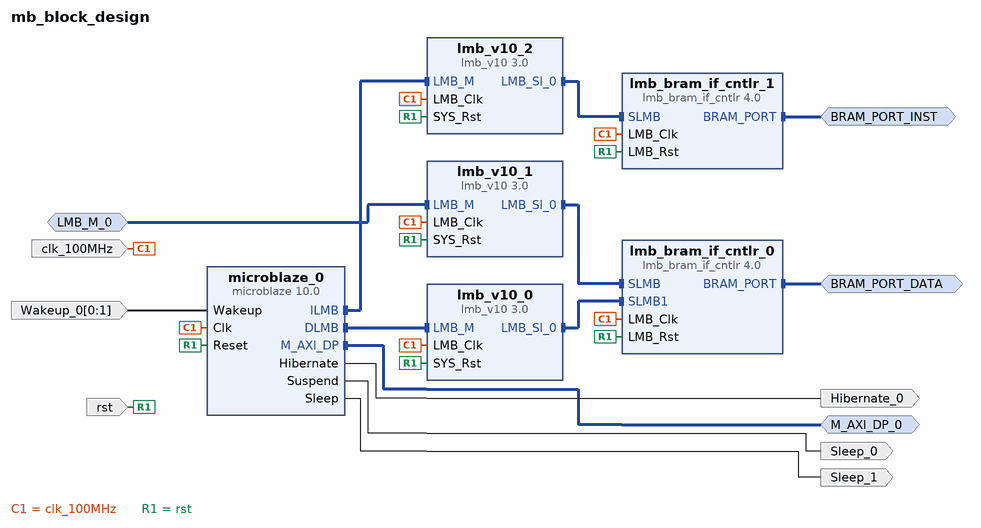
[diagram p0: block diagram of the top level]
# Vivado block design mb_block_design, xc7a200tfbg676-2, Vivado 2018.2.1
create_bd_design mb_block_design

create_bd_intf_port -mode Master -vlnv xilinx.com:interface:aximm_rtl:1.0 M_AXI_DP_0
set_property -dict [list \
  CONFIG.DATA_WIDTH 32 \
  CONFIG.PROTOCOL AXI4LITE \
  CONFIG.ADDR_WIDTH 32 \
  CONFIG.HAS_BURST 0 \
  CONFIG.HAS_LOCK 0 \
  CONFIG.HAS_CACHE 0 \
  CONFIG.HAS_QOS 0 \
  CONFIG.HAS_REGION 0 \
] [get_bd_intf_ports M_AXI_DP_0]
create_bd_intf_port -mode MirroredMaster -vlnv xilinx.com:interface:lmb_rtl:1.0 LMB_M_0
create_bd_intf_port -mode Master -vlnv xilinx.com:interface:bram_rtl:1.0 BRAM_PORT_INST
set_property -dict {CONFIG.MASTER_TYPE BRAM_CTRL} [get_bd_intf_ports BRAM_PORT_INST]
create_bd_intf_port -mode Master -vlnv xilinx.com:interface:bram_rtl:1.0 BRAM_PORT_DATA
set_property -dict {CONFIG.MASTER_TYPE BRAM_CTRL} [get_bd_intf_ports BRAM_PORT_DATA]
create_bd_port -dir I -type clk clk_100MHz
set_property -dict {CONFIG.FREQ_HZ 100000000} [get_bd_ports clk_100MHz]
create_bd_port -dir I -type rst rst
set_property -dict {CONFIG.POLARITY ACTIVE_HIGH} [get_bd_ports rst]
create_bd_port -dir I -from 0 -to 1 Wakeup_0
create_bd_port -dir O Sleep_0
create_bd_port -dir O Hibernate_0
create_bd_port -dir O Sleep_1

create_bd_cell -type ip -vlnv xilinx.com:ip:microblaze:10.0 microblaze_0
set_property -dict [list \
  CONFIG.C_INTERCONNECT 2 \
  CONFIG.C_D_AXI 1 \
  CONFIG.C_D_LMB 1 \
  CONFIG.C_I_LMB 1 \
  CONFIG.C_TRACE 0 \
  CONFIG.C_LOCKSTEP_SELECT 0 \
  CONFIG.C_ENABLE_DISCRETE_PORTS 1 \
  CONFIG.C_USE_PCMP_INSTR 1 \
  CONFIG.C_USE_BARREL 1 \
  CONFIG.C_USE_DIV 1 \
  CONFIG.C_USE_HW_MUL 1 \
  CONFIG.C_USE_FPU 1 \
  CONFIG.C_DEBUG_ENABLED 0 \
  CONFIG.C_ADDR_TAG_BITS 0 \
  CONFIG.C_DCACHE_ADDR_TAG 0 \
  CONFIG.C_USE_MMU 0 \
] [get_bd_cells microblaze_0]
create_bd_cell -type ip -vlnv xilinx.com:ip:lmb_v10:3.0 lmb_v10_0
set_property -dict {CONFIG.C_LMB_NUM_SLAVES 1} [get_bd_cells lmb_v10_0]
create_bd_cell -type ip -vlnv xilinx.com:ip:lmb_v10:3.0 lmb_v10_1
create_bd_cell -type ip -vlnv xilinx.com:ip:lmb_bram_if_cntlr:4.0 lmb_bram_if_cntlr_0
set_property -dict {CONFIG.C_NUM_LMB 2} [get_bd_cells lmb_bram_if_cntlr_0]
create_bd_cell -type ip -vlnv xilinx.com:ip:lmb_v10:3.0 lmb_v10_2
create_bd_cell -type ip -vlnv xilinx.com:ip:lmb_bram_if_cntlr:4.0 lmb_bram_if_cntlr_1

# ---- connections ----

connect_bd_intf_net [get_bd_intf_pins microblaze_0/DLMB] [get_bd_intf_pins lmb_v10_0/LMB_M]
connect_bd_intf_net [get_bd_intf_pins lmb_v10_1/LMB_Sl_0] [get_bd_intf_pins lmb_bram_if_cntlr_0/SLMB]
connect_bd_intf_net [get_bd_intf_pins lmb_v10_0/LMB_Sl_0] [get_bd_intf_pins lmb_bram_if_cntlr_0/SLMB1]
connect_bd_intf_net [get_bd_intf_pins lmb_v10_2/LMB_Sl_0] [get_bd_intf_pins lmb_bram_if_cntlr_1/SLMB]
connect_bd_intf_net [get_bd_intf_pins microblaze_0/ILMB] [get_bd_intf_pins lmb_v10_2/LMB_M]
connect_bd_intf_net [get_bd_intf_ports M_AXI_DP_0] [get_bd_intf_pins microblaze_0/M_AXI_DP]
connect_bd_intf_net [get_bd_intf_ports LMB_M_0] [get_bd_intf_pins lmb_v10_1/LMB_M]
connect_bd_intf_net [get_bd_intf_ports BRAM_PORT_INST] [get_bd_intf_pins lmb_bram_if_cntlr_1/BRAM_PORT]
connect_bd_intf_net [get_bd_intf_ports BRAM_PORT_DATA] [get_bd_intf_pins lmb_bram_if_cntlr_0/BRAM_PORT]
connect_bd_net [get_bd_ports clk_100MHz] \
  [get_bd_pins lmb_v10_1/LMB_Clk] [get_bd_pins microblaze_0/Clk] [get_bd_pins lmb_v10_2/LMB_Clk] \
  [get_bd_pins lmb_bram_if_cntlr_0/LMB_Clk] [get_bd_pins lmb_bram_if_cntlr_1/LMB_Clk] [get_bd_pins lmb_v10_0/LMB_Clk]
connect_bd_net [get_bd_ports rst] \
  [get_bd_pins microblaze_0/Reset] [get_bd_pins lmb_v10_2/SYS_Rst] [get_bd_pins lmb_bram_if_cntlr_1/LMB_Rst] \
  [get_bd_pins lmb_bram_if_cntlr_0/LMB_Rst] [get_bd_pins lmb_v10_0/SYS_Rst] [get_bd_pins lmb_v10_1/SYS_Rst]
connect_bd_net -net Wakeup_0_1 [get_bd_ports Wakeup_0] [get_bd_pins microblaze_0/Wakeup]
connect_bd_net [get_bd_pins microblaze_0/Suspend] [get_bd_ports Sleep_0]
connect_bd_net [get_bd_pins microblaze_0/Hibernate] [get_bd_ports Hibernate_0]
connect_bd_net [get_bd_pins microblaze_0/Sleep] [get_bd_ports Sleep_1]

# ---- address map ----
assign_bd_address -offset 0x00000000 -range 8K -target_address_space [get_bd_addr_spaces LMB_M_0] [get_bd_addr_segs lmb_bram_if_cntlr_0/SLMB/Mem]
assign_bd_address -offset 0x00000000 -range 8K -target_address_space [get_bd_addr_spaces microblaze_0/Data] [get_bd_addr_segs lmb_bram_if_cntlr_0/SLMB1/Mem]
assign_bd_address -offset 0x44A00000 -range 64K -target_address_space [get_bd_addr_spaces microblaze_0/Data] [get_bd_addr_segs M_AXI_DP_0/Reg]
assign_bd_address -offset 0x00000000 -range 8K -target_address_space [get_bd_addr_spaces microblaze_0/Instruction] [get_bd_addr_segs lmb_bram_if_cntlr_1/SLMB/Mem]

validate_bd_design
save_bd_design
